# Altium schematic sheet [19]-DDR4_260_PIN_CON.SchDoc: RK3399 SOM Board Design V1.0
size A3; Author: ABC; Organization: Altium Limited; Address1: L3, 12a Rodborough Rd; Address2: Frenchs Forest; Address3: NSW; Address4: Australia 2086; DocumentNumber: 21; SheetNumber: 21; SheetTotal: 21; PROJECT CODE: A_V1.0
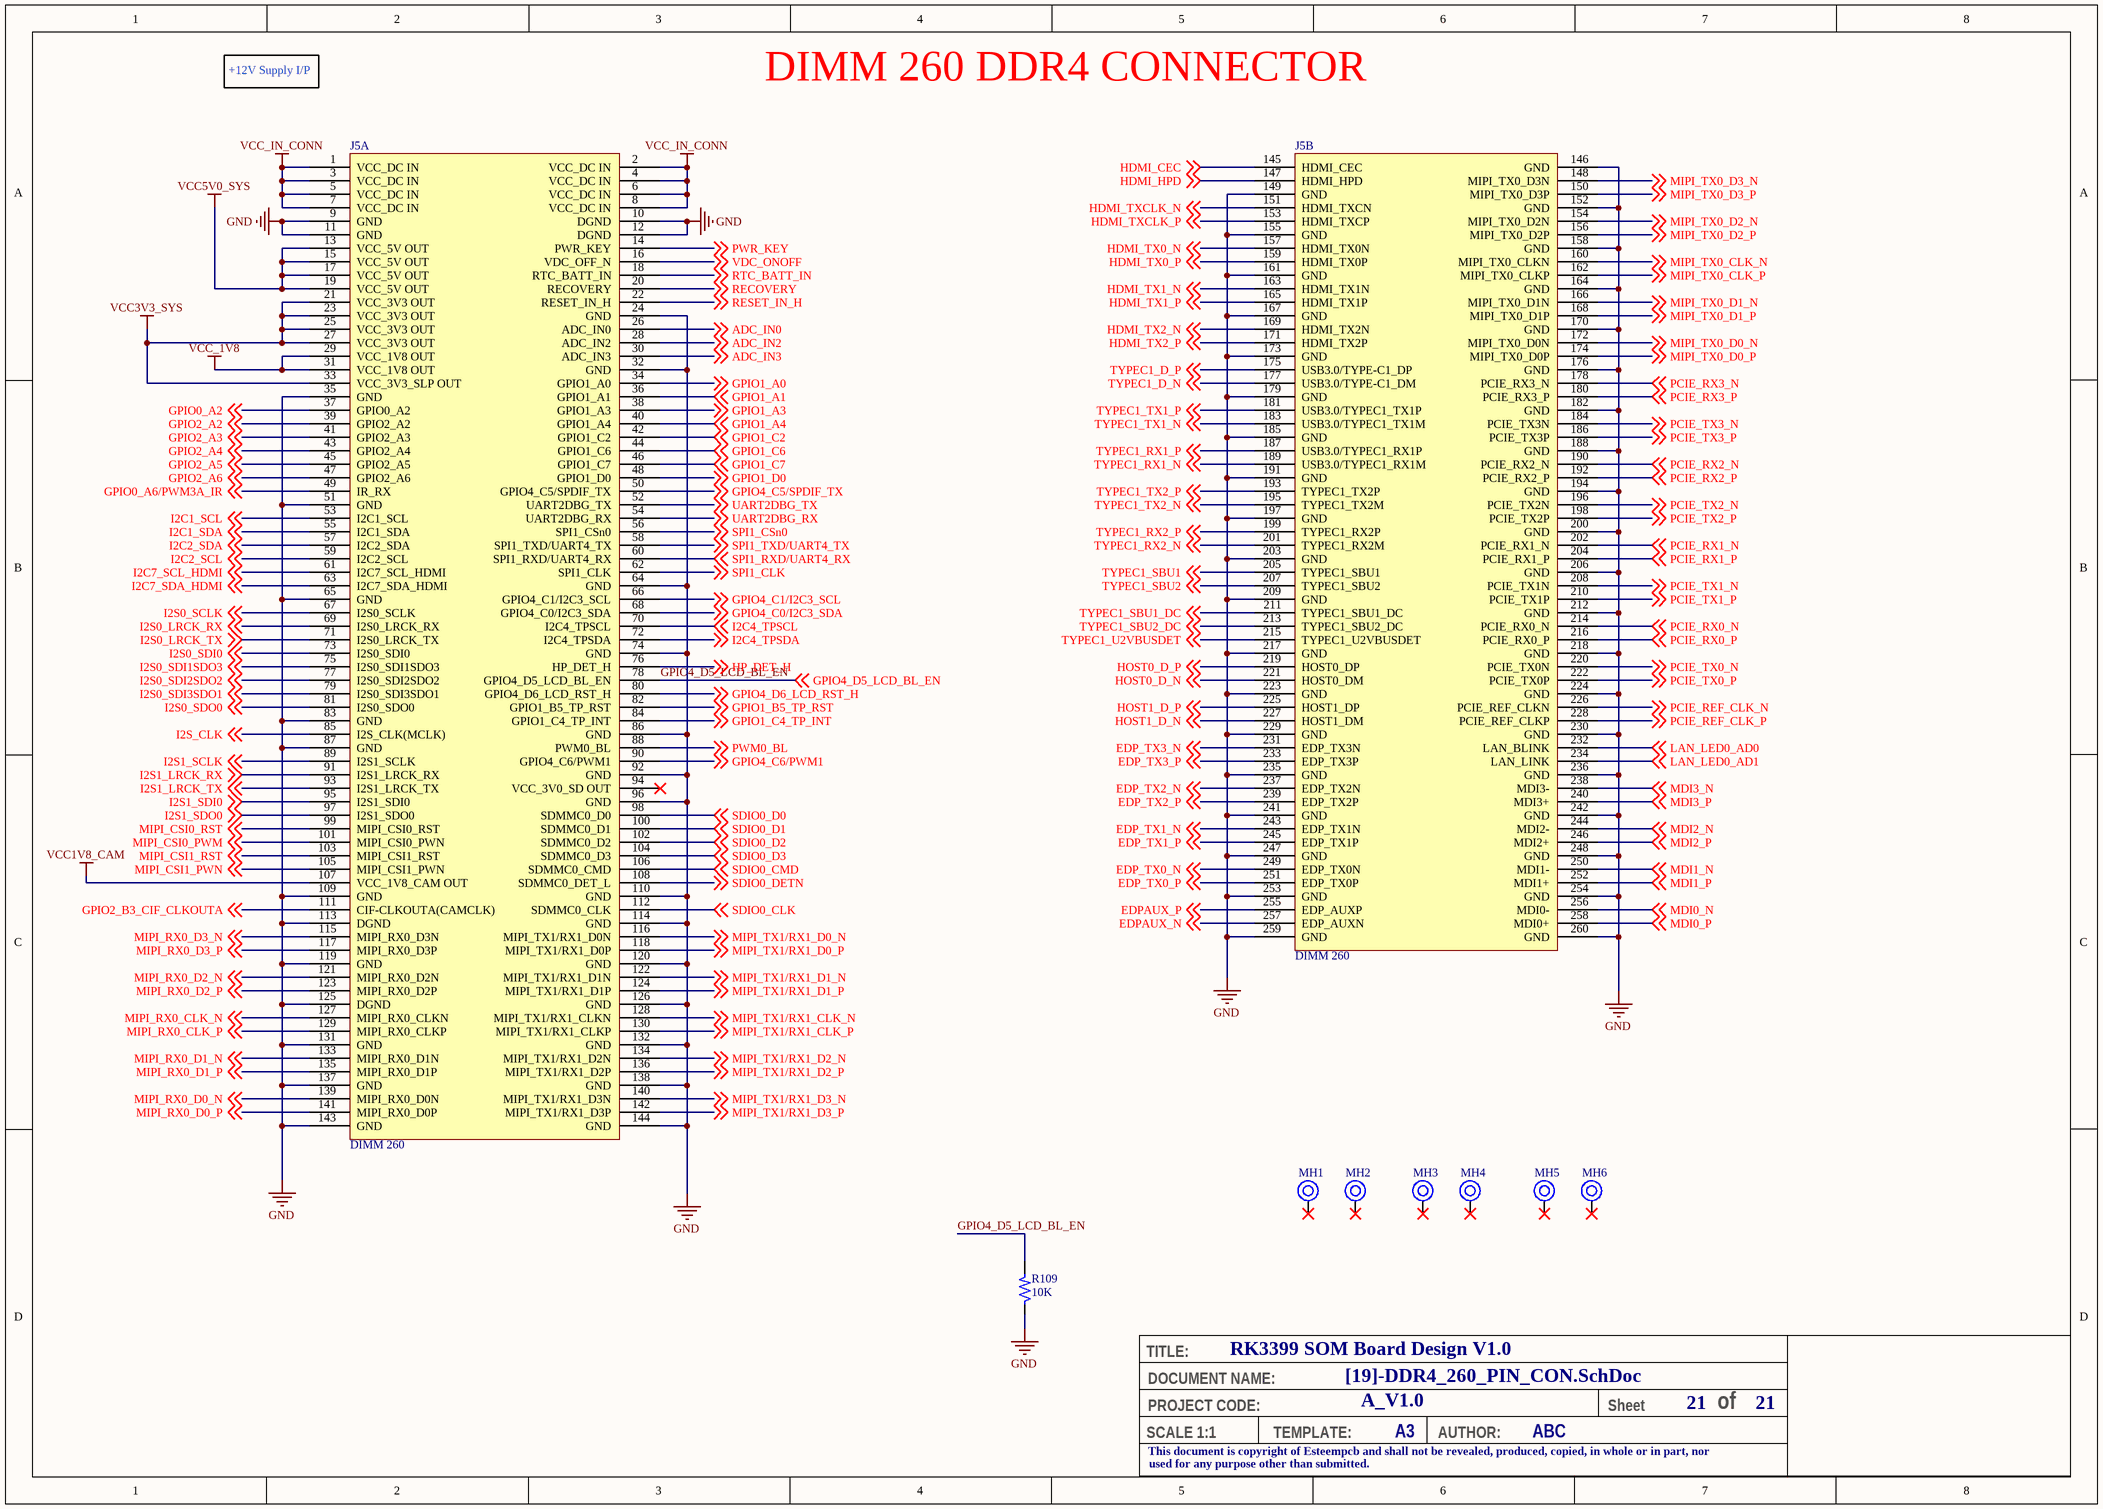
[diagram p0: [19]-DDR4_260_PIN_CON.SchDoc]

## Parts
J5  DIMM 260  [DIMM260_DDR4]  (parts A,B of 2)
MH1  Mounting Hole  [SOM_Mounting]  (value not drawn)  (no BOM)
MH2  Mounting Hole  [SOM_Mounting]  (value not drawn)  (no BOM)
MH3  Mounting Hole  [SOM_Mounting]  (value not drawn)  (no BOM)
MH4  Mounting Hole  [SOM_Mounting]  (value not drawn)  (no BOM)
MH5  Mounting Hole  [SOM_Mounting]  (value not drawn)  (no BOM)
MH6  Mounting Hole  [SOM_Mounting]  (value not drawn)  (no BOM)
R109  10K  [RES_0402]

## Nets
GND: J5.9(GND) J5.10(DGND) J5.11(GND) J5.12(DGND) J5.24(GND) J5.32(GND) J5.35(GND) J5.51(GND) J5.64(GND) J5.65(GND) J5.74(GND) J5.83(GND) J5.86(GND) J5.87(GND) J5.92(GND) J5.96(GND) J5.109(GND) J5.110(GND) J5.113(DGND) J5.114(GND) J5.119(GND) J5.120(GND) J5.125(DGND) J5.126(GND) J5.131(GND) J5.132(GND) J5.137(GND) J5.138(GND) J5.143(GND) J5.144(GND) J5.146(GND) J5.149(GND) J5.152(GND) J5.155(GND) J5.158(GND) J5.161(GND) J5.164(GND) J5.167(GND) J5.170(GND) J5.173(GND) J5.176(GND) J5.179(GND) J5.182(GND) J5.185(GND) J5.188(GND) J5.191(GND) J5.194(GND) J5.197(GND) J5.200(GND) J5.203(GND) J5.206(GND) J5.209(GND) J5.212(GND) J5.217(GND) J5.218(GND) J5.223(GND) J5.224(GND) J5.229(GND) J5.230(GND) J5.235(GND) J5.236(GND) J5.241(GND) J5.242(GND) J5.247(GND) J5.248(GND) J5.253(GND) J5.254(GND) J5.259(GND) J5.260(GND) R109.1
VCC1V8_CAM: J5.107(VCC_1V8_CAM_OUT)
VCC3V3_SYS: J5.21(VCC_3V3_OUT) J5.23(VCC_3V3_OUT) J5.25(VCC_3V3_OUT) J5.27(VCC_3V3_OUT) J5.33(VCC_3V3_SLP_OUT)
VCC5V0_SYS: J5.13(VCC_5V_OUT) J5.15(VCC_5V_OUT) J5.17(VCC_5V_OUT) J5.19(VCC_5V_OUT)
VCC_1V8: J5.29(VCC_1V8_OUT) J5.31(VCC_1V8_OUT)
VCC_IN_CONN: J5.1(VCC_DC_IN) J5.2(VCC_DC_IN) J5.3(VCC_DC_IN) J5.4(VCC_DC_IN) J5.5(VCC_DC_IN) J5.6(VCC_DC_IN) J5.7(VCC_DC_IN) J5.8(VCC_DC_IN)
ADC_IN0: J5.26(ADC_IN0) ; off-sheet ADC_IN0
ADC_IN2: J5.28(ADC_IN2) ; off-sheet ADC_IN2
ADC_IN3: J5.30(ADC_IN3) ; off-sheet ADC_IN3
EDP_TX0_N: J5.249(EDP_TX0N) ; off-sheet EDP_TX0_N
EDP_TX0_P: J5.251(EDP_TX0P) ; off-sheet EDP_TX0_P
EDP_TX1_N: J5.243(EDP_TX1N) ; off-sheet EDP_TX1_N
EDP_TX1_P: J5.245(EDP_TX1P) ; off-sheet EDP_TX1_P
EDP_TX2_N: J5.237(EDP_TX2N) ; off-sheet EDP_TX2_N
EDP_TX2_P: J5.239(EDP_TX2P) ; off-sheet EDP_TX2_P
EDP_TX3_N: J5.231(EDP_TX3N) ; off-sheet EDP_TX3_N
EDP_TX3_P: J5.233(EDP_TX3P) ; off-sheet EDP_TX3_P
EDPAUX_N: J5.257(EDP_AUXN) ; off-sheet EDPAUX_N
EDPAUX_P: J5.255(EDP_AUXP) ; off-sheet EDPAUX_P
GPIO0_A2: J5.37(GPIO0_A2) ; off-sheet GPIO0_A2
GPIO0_A6/PWM3A_IR: J5.49(IR_RX) ; off-sheet GPIO0_A6/PWM3A_IR
GPIO1_A0: J5.34(GPIO1_A0) ; off-sheet GPIO1_A0
GPIO1_A1: J5.36(GPIO1_A1) ; off-sheet GPIO1_A1
GPIO1_A3: J5.38(GPIO1_A3) ; off-sheet GPIO1_A3
GPIO1_A4: J5.40(GPIO1_A4) ; off-sheet GPIO1_A4
GPIO1_B5_TP_RST: J5.82(GPIO1_B5_TP_RST) ; off-sheet GPIO1_B5_TP_RST
GPIO1_C2: J5.42(GPIO1_C2) ; off-sheet GPIO1_C2
GPIO1_C4_TP_INT: J5.84(GPIO1_C4_TP_INT) ; off-sheet GPIO1_C4_TP_INT
GPIO1_C6: J5.44(GPIO1_C6) ; off-sheet GPIO1_C6
GPIO1_C7: J5.46(GPIO1_C7) ; off-sheet GPIO1_C7
GPIO1_D0: J5.48(GPIO1_D0) ; off-sheet GPIO1_D0
GPIO2_A2: J5.39(GPIO2_A2) ; off-sheet GPIO2_A2
GPIO2_A3: J5.41(GPIO2_A3) ; off-sheet GPIO2_A3
GPIO2_A4: J5.43(GPIO2_A4) ; off-sheet GPIO2_A4
GPIO2_A5: J5.45(GPIO2_A5) ; off-sheet GPIO2_A5
GPIO2_A6: J5.47(GPIO2_A6) ; off-sheet GPIO2_A6
GPIO2_B3_CIF_CLKOUTA: J5.111(CIF-CLKOUTA(CAMCLK)) ; off-sheet GPIO2_B3_CIF_CLKOUTA
GPIO4_C0/I2C3_SDA: J5.68(GPIO4_C0/I2C3_SDA) ; off-sheet GPIO4_C0/I2C3_SDA
GPIO4_C1/I2C3_SCL: J5.66(GPIO4_C1/I2C3_SCL) ; off-sheet GPIO4_C1/I2C3_SCL
GPIO4_C5/SPDIF_TX: J5.50(GPIO4_C5/SPDIF_TX) ; off-sheet GPIO4_C5/SPDIF_TX
GPIO4_C6/PWM1: J5.90(GPIO4_C6/PWM1) ; off-sheet GPIO4_C6/PWM1
GPIO4_D5_LCD_BL_EN: J5.78(GPIO4_D5_LCD_BL_EN) R109.2 ; off-sheet GPIO4_D5_LCD_BL_EN
GPIO4_D6_LCD_RST_H: J5.80(GPIO4_D6_LCD_RST_H) ; off-sheet GPIO4_D6_LCD_RST_H
HDMI_CEC: J5.145(HDMI_CEC) ; off-sheet HDMI_CEC
HDMI_HPD: J5.147(HDMI_HPD) ; off-sheet HDMI_HPD
HDMI_TX0_N: J5.157(HDMI_TX0N) ; off-sheet HDMI_TX0_N
HDMI_TX0_P: J5.159(HDMI_TX0P) ; off-sheet HDMI_TX0_P
HDMI_TX1_N: J5.163(HDMI_TX1N) ; off-sheet HDMI_TX1_N
HDMI_TX1_P: J5.165(HDMI_TX1P) ; off-sheet HDMI_TX1_P
HDMI_TX2_N: J5.169(HDMI_TX2N) ; off-sheet HDMI_TX2_N
HDMI_TX2_P: J5.171(HDMI_TX2P) ; off-sheet HDMI_TX2_P
HDMI_TXCLK_N: J5.151(HDMI_TXCN) ; off-sheet HDMI_TXCLK_N
HDMI_TXCLK_P: J5.153(HDMI_TXCP) ; off-sheet HDMI_TXCLK_P
HOST0_D_N: J5.221(HOST0_DM) ; off-sheet HOST0_D_N
HOST0_D_P: J5.219(HOST0_DP) ; off-sheet HOST0_D_P
HOST1_D_N: J5.227(HOST1_DM) ; off-sheet HOST1_D_N
HOST1_D_P: J5.225(HOST1_DP) ; off-sheet HOST1_D_P
HP_DET_H: J5.76(HP_DET_H) ; off-sheet HP_DET_H
I2C1_SCL: J5.53(I2C1_SCL) ; off-sheet I2C1_SCL
I2C1_SDA: J5.55(I2C1_SDA) ; off-sheet I2C1_SDA
I2C2_SCL: J5.59(I2C2_SCL) ; off-sheet I2C2_SCL
I2C2_SDA: J5.57(I2C2_SDA) ; off-sheet I2C2_SDA
I2C4_TPSCL: J5.70(I2C4_TPSCL) ; off-sheet I2C4_TPSCL
I2C4_TPSDA: J5.72(I2C4_TPSDA) ; off-sheet I2C4_TPSDA
I2C7_SCL_HDMI: J5.61(I2C7_SCL_HDMI) ; off-sheet I2C7_SCL_HDMI
I2C7_SDA_HDMI: J5.63(I2C7_SDA_HDMI) ; off-sheet I2C7_SDA_HDMI
I2S0_LRCK_RX: J5.69(I2S0_LRCK_RX) ; off-sheet I2S0_LRCK_RX
I2S0_LRCK_TX: J5.71(I2S0_LRCK_TX) ; off-sheet I2S0_LRCK_TX
I2S0_SCLK: J5.67(I2S0_SCLK) ; off-sheet I2S0_SCLK
I2S0_SDI0: J5.73(I2S0_SDI0) ; off-sheet I2S0_SDI0
I2S0_SDI1SDO3: J5.75(I2S0_SDI1SDO3) ; off-sheet I2S0_SDI1SDO3
I2S0_SDI2SDO2: J5.77(I2S0_SDI2SDO2) ; off-sheet I2S0_SDI2SDO2
I2S0_SDI3SDO1: J5.79(I2S0_SDI3SDO1) ; off-sheet I2S0_SDI3SDO1
I2S0_SDO0: J5.81(I2S0_SDO0) ; off-sheet I2S0_SDO0
I2S1_LRCK_RX: J5.91(I2S1_LRCK_RX) ; off-sheet I2S1_LRCK_RX
I2S1_LRCK_TX: J5.93(I2S1_LRCK_TX) ; off-sheet I2S1_LRCK_TX
I2S1_SCLK: J5.89(I2S1_SCLK) ; off-sheet I2S1_SCLK
I2S1_SDI0: J5.95(I2S1_SDI0) ; off-sheet I2S1_SDI0
I2S1_SDO0: J5.97(I2S1_SDO0) ; off-sheet I2S1_SDO0
I2S_CLK: J5.85(I2S_CLK(MCLK)) ; off-sheet I2S_CLK
LAN_LED0_AD0: J5.232(LAN_BLINK) ; off-sheet LAN_LED0_AD0
LAN_LED0_AD1: J5.234(LAN_LINK) ; off-sheet LAN_LED0_AD1
MDI0_N: J5.256(MDI0-) ; off-sheet MDI0_N
MDI0_P: J5.258(MDI0+) ; off-sheet MDI0_P
MDI1_N: J5.250(MDI1-) ; off-sheet MDI1_N
MDI1_P: J5.252(MDI1+) ; off-sheet MDI1_P
MDI2_N: J5.244(MDI2-) ; off-sheet MDI2_N
MDI2_P: J5.246(MDI2+) ; off-sheet MDI2_P
MDI3_N: J5.238(MDI3-) ; off-sheet MDI3_N
MDI3_P: J5.240(MDI3+) ; off-sheet MDI3_P
MIPI_CSI0_PWM: J5.101(MIPI_CSI0_PWN) ; off-sheet MIPI_CSI0_PWM
MIPI_CSI0_RST: J5.99(MIPI_CSI0_RST) ; off-sheet MIPI_CSI0_RST
MIPI_CSI1_PWN: J5.105(MIPI_CSI1_PWN) ; off-sheet MIPI_CSI1_PWN
MIPI_CSI1_RST: J5.103(MIPI_CSI1_RST) ; off-sheet MIPI_CSI1_RST
MIPI_RX0_CLK_N: J5.127(MIPI_RX0_CLKN) ; off-sheet MIPI_RX0_CLK_N
MIPI_RX0_CLK_P: J5.129(MIPI_RX0_CLKP) ; off-sheet MIPI_RX0_CLK_P
MIPI_RX0_D0_N: J5.139(MIPI_RX0_D0N) ; off-sheet MIPI_RX0_D0_N
MIPI_RX0_D0_P: J5.141(MIPI_RX0_D0P) ; off-sheet MIPI_RX0_D0_P
MIPI_RX0_D1_N: J5.133(MIPI_RX0_D1N) ; off-sheet MIPI_RX0_D1_N
MIPI_RX0_D1_P: J5.135(MIPI_RX0_D1P) ; off-sheet MIPI_RX0_D1_P
MIPI_RX0_D2_N: J5.121(MIPI_RX0_D2N) ; off-sheet MIPI_RX0_D2_N
MIPI_RX0_D2_P: J5.123(MIPI_RX0_D2P) ; off-sheet MIPI_RX0_D2_P
MIPI_RX0_D3_N: J5.115(MIPI_RX0_D3N) ; off-sheet MIPI_RX0_D3_N
MIPI_RX0_D3_P: J5.117(MIPI_RX0_D3P) ; off-sheet MIPI_RX0_D3_P
MIPI_TX0_CLK_N: J5.160(MIPI_TX0_CLKN) ; off-sheet MIPI_TX0_CLK_N
MIPI_TX0_CLK_P: J5.162(MIPI_TX0_CLKP) ; off-sheet MIPI_TX0_CLK_P
MIPI_TX0_D0_N: J5.172(MIPI_TX0_D0N) ; off-sheet MIPI_TX0_D0_N
MIPI_TX0_D0_P: J5.174(MIPI_TX0_D0P) ; off-sheet MIPI_TX0_D0_P
MIPI_TX0_D1_N: J5.166(MIPI_TX0_D1N) ; off-sheet MIPI_TX0_D1_N
MIPI_TX0_D1_P: J5.168(MIPI_TX0_D1P) ; off-sheet MIPI_TX0_D1_P
MIPI_TX0_D2_N: J5.154(MIPI_TX0_D2N) ; off-sheet MIPI_TX0_D2_N
MIPI_TX0_D2_P: J5.156(MIPI_TX0_D2P) ; off-sheet MIPI_TX0_D2_P
MIPI_TX0_D3_N: J5.148(MIPI_TX0_D3N) ; off-sheet MIPI_TX0_D3_N
MIPI_TX0_D3_P: J5.150(MIPI_TX0_D3P) ; off-sheet MIPI_TX0_D3_P
MIPI_TX1/RX1_CLK_N: J5.128(MIPI_TX1/RX1_CLKN) ; off-sheet MIPI_TX1/RX1_CLK_N
MIPI_TX1/RX1_CLK_P: J5.130(MIPI_TX1/RX1_CLKP) ; off-sheet MIPI_TX1/RX1_CLK_P
MIPI_TX1/RX1_D0_N: J5.116(MIPI_TX1/RX1_D0N) ; off-sheet MIPI_TX1/RX1_D0_N
MIPI_TX1/RX1_D0_P: J5.118(MIPI_TX1/RX1_D0P) ; off-sheet MIPI_TX1/RX1_D0_P
MIPI_TX1/RX1_D1_N: J5.122(MIPI_TX1/RX1_D1N) ; off-sheet MIPI_TX1/RX1_D1_N
MIPI_TX1/RX1_D1_P: J5.124(MIPI_TX1/RX1_D1P) ; off-sheet MIPI_TX1/RX1_D1_P
MIPI_TX1/RX1_D2_N: J5.134(MIPI_TX1/RX1_D2N) ; off-sheet MIPI_TX1/RX1_D2_N
MIPI_TX1/RX1_D2_P: J5.136(MIPI_TX1/RX1_D2P) ; off-sheet MIPI_TX1/RX1_D2_P
MIPI_TX1/RX1_D3_N: J5.140(MIPI_TX1/RX1_D3N) ; off-sheet MIPI_TX1/RX1_D3_N
MIPI_TX1/RX1_D3_P: J5.142(MIPI_TX1/RX1_D3P) ; off-sheet MIPI_TX1/RX1_D3_P
PCIE_REF_CLK_N: J5.226(PCIE_REF_CLKN) ; off-sheet PCIE_REF_CLK_N
PCIE_REF_CLK_P: J5.228(PCIE_REF_CLKP) ; off-sheet PCIE_REF_CLK_P
PCIE_RX0_N: J5.214(PCIE_RX0_N) ; off-sheet PCIE_RX0_N
PCIE_RX0_P: J5.216(PCIE_RX0_P) ; off-sheet PCIE_RX0_P
PCIE_RX1_N: J5.202(PCIE_RX1_N) ; off-sheet PCIE_RX1_N
PCIE_RX1_P: J5.204(PCIE_RX1_P) ; off-sheet PCIE_RX1_P
PCIE_RX2_N: J5.190(PCIE_RX2_N) ; off-sheet PCIE_RX2_N
PCIE_RX2_P: J5.192(PCIE_RX2_P) ; off-sheet PCIE_RX2_P
PCIE_RX3_N: J5.178(PCIE_RX3_N) ; off-sheet PCIE_RX3_N
PCIE_RX3_P: J5.180(PCIE_RX3_P) ; off-sheet PCIE_RX3_P
PCIE_TX0_N: J5.220(PCIE_TX0N) ; off-sheet PCIE_TX0_N
PCIE_TX0_P: J5.222(PCIE_TX0P) ; off-sheet PCIE_TX0_P
PCIE_TX1_N: J5.208(PCIE_TX1N) ; off-sheet PCIE_TX1_N
PCIE_TX1_P: J5.210(PCIE_TX1P) ; off-sheet PCIE_TX1_P
PCIE_TX2_N: J5.196(PCIE_TX2N) ; off-sheet PCIE_TX2_N
PCIE_TX2_P: J5.198(PCIE_TX2P) ; off-sheet PCIE_TX2_P
PCIE_TX3_N: J5.184(PCIE_TX3N) ; off-sheet PCIE_TX3_N
PCIE_TX3_P: J5.186(PCIE_TX3P) ; off-sheet PCIE_TX3_P
PWM0_BL: J5.88(PWM0_BL) ; off-sheet PWM0_BL
PWR_KEY: J5.14(PWR_KEY) ; off-sheet PWR_KEY
RECOVERY: J5.20(RECOVERY) ; off-sheet RECOVERY
RESET_IN_H: J5.22(RESET_IN_H) ; off-sheet RESET_IN_H
RTC_BATT_IN: J5.18(RTC_BATT_IN) ; off-sheet RTC_BATT_IN
SDIO0_CLK: J5.112(SDMMC0_CLK) ; off-sheet SDIO0_CLK
SDIO0_CMD: J5.106(SDMMC0_CMD) ; off-sheet SDIO0_CMD
SDIO0_D0: J5.98(SDMMC0_D0) ; off-sheet SDIO0_D0
SDIO0_D1: J5.100(SDMMC0_D1) ; off-sheet SDIO0_D1
SDIO0_D2: J5.102(SDMMC0_D2) ; off-sheet SDIO0_D2
SDIO0_D3: J5.104(SDMMC0_D3) ; off-sheet SDIO0_D3
SDIO0_DETN: J5.108(SDMMC0_DET_L) ; off-sheet SDIO0_DETN
SPI1_CLK: J5.62(SPI1_CLK) ; off-sheet SPI1_CLK
SPI1_CSn0: J5.56(SPI1_CSn0) ; off-sheet SPI1_CSn0
SPI1_RXD/UART4_RX: J5.60(SPI1_RXD/UART4_RX) ; off-sheet SPI1_RXD/UART4_RX
SPI1_TXD/UART4_TX: J5.58(SPI1_TXD/UART4_TX) ; off-sheet SPI1_TXD/UART4_TX
TYPEC1_D_N: J5.177(USB3.0/TYPE-C1_DM) ; off-sheet TYPEC1_D_N
TYPEC1_D_P: J5.175(USB3.0/TYPE-C1_DP) ; off-sheet TYPEC1_D_P
TYPEC1_RX1_N: J5.189(USB3.0/TYPEC1_RX1M) ; off-sheet TYPEC1_RX1_N
TYPEC1_RX1_P: J5.187(USB3.0/TYPEC1_RX1P) ; off-sheet TYPEC1_RX1_P
TYPEC1_RX2_N: J5.201(TYPEC1_RX2M) ; off-sheet TYPEC1_RX2_N
TYPEC1_RX2_P: J5.199(TYPEC1_RX2P) ; off-sheet TYPEC1_RX2_P
TYPEC1_SBU1: J5.205(TYPEC1_SBU1) ; off-sheet TYPEC1_SBU1
TYPEC1_SBU1_DC: J5.211(TYPEC1_SBU1_DC) ; off-sheet TYPEC1_SBU1_DC
TYPEC1_SBU2: J5.207(TYPEC1_SBU2) ; off-sheet TYPEC1_SBU2
TYPEC1_SBU2_DC: J5.213(TYPEC1_SBU2_DC) ; off-sheet TYPEC1_SBU2_DC
TYPEC1_TX1_N: J5.183(USB3.0/TYPEC1_TX1M) ; off-sheet TYPEC1_TX1_N
TYPEC1_TX1_P: J5.181(USB3.0/TYPEC1_TX1P) ; off-sheet TYPEC1_TX1_P
TYPEC1_TX2_N: J5.195(TYPEC1_TX2M) ; off-sheet TYPEC1_TX2_N
TYPEC1_TX2_P: J5.193(TYPEC1_TX2P) ; off-sheet TYPEC1_TX2_P
TYPEC1_U2VBUSDET: J5.215(TYPEC1_U2VBUSDET) ; off-sheet TYPEC1_U2VBUSDET
UART2DBG_RX: J5.54(UART2DBG_RX) ; off-sheet UART2DBG_RX
UART2DBG_TX: J5.52(UART2DBG_TX) ; off-sheet UART2DBG_TX
VDC_ONOFF: J5.16(VDC_OFF_N) ; off-sheet VDC_ONOFF

Not connected (* = marked no-connect by the designer): J5 94(VCC_3V0_SD_OUT)*; MH1 1*; MH2 1*; MH3 1*; MH4 1*; MH5 1*; MH6 1*

## Notes on the sheet
- +12V Supply I/P
- DIMM 260 DDR4 CONNECTOR
- TITLE:
- DOCUMENT NAME:
- SCALE 1:1
- This document is copyright of Esteempcb and shall not be revealed, produced, copied, in whole or in part, nor
- PROJECT CODE:
- TEMPLATE:
- A3
- AUTHOR:
- Sheet
- of
- used for any purpose other than submitted.

## Library data of the parts
J5 = CON-DIMM_260-SMD: Dimm 260 pin smd plating on pcb; Manufacturer: NA; Manufacturer Part Number: NA; Case/Package: NA; Supplier-1: NA
MH1-MH6 = MH_3.5H_6D: Manufacturer Part Number: NA; Case/Package: TH; Manufacturer: NA; Supplier-1: NA
R109 = RES_10K-0.1W-1%-0402: 10 kOhms ±1% 0.1W, 1/10W Chip Resistor 0402 (1005 Metric) Anti-Sulfur Thin Film /; Manufacturer: Vishay Beyschlag/Draloric/BC Components; Manufacturer Part Number: MCS04020C1002FE000; Case/Package: 0402; Supplier-1: Digikey